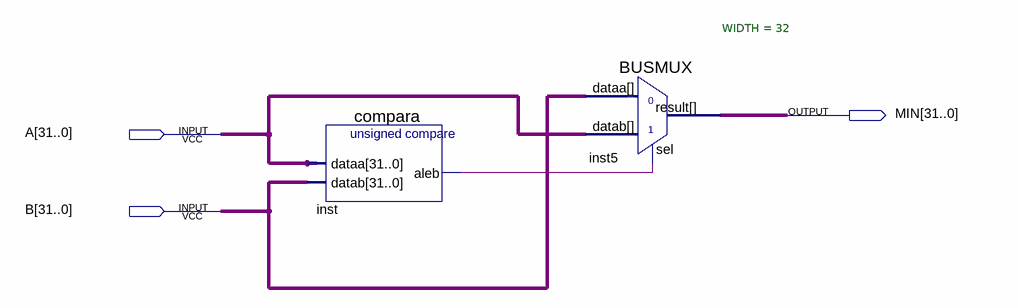
[diagram p0: schematic sheet]
// Quartus schematic Min.bdf as structural Verilog: 2 symbols, 3 pins
module Min (
  input  [31:0] A,
  input  [31:0] B,
  output [31:0] MIN
);

  wire inst_aleb;

  compara inst (.dataa(A), .datab(B), .aleb(inst_aleb));
  BUSMUX #(.WIDTH(32)) inst5 (.datab(A), .sel(inst_aleb), .dataa(B), .result(MIN));
endmodule
